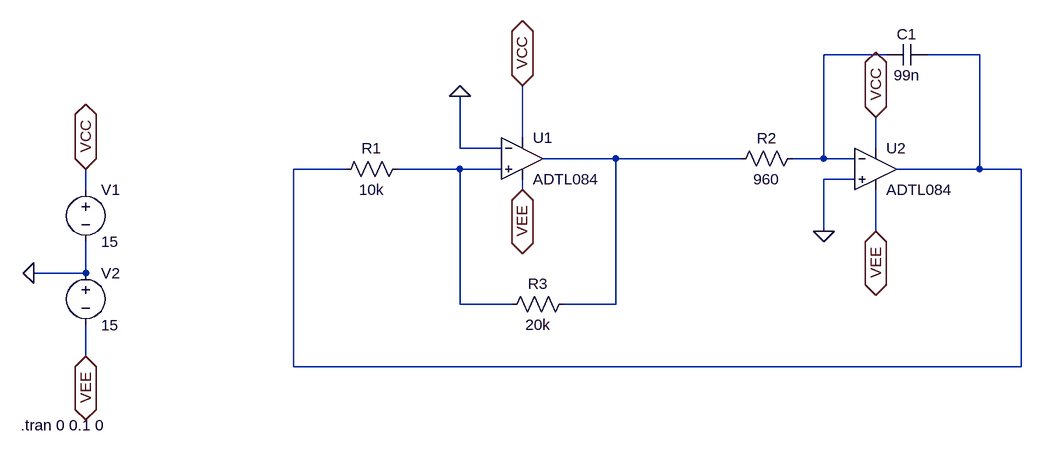
[diagram p0: schematic Oscillator_Integrator.asc]
Oscillator_Integrator.asc, the LTspice schematic file:
Version 4
SHEET 1 1444 680
WIRE 1232 -144 1136 -144
WIRE 1376 -144 1296 -144
WIRE 672 -16 672 -96
WIRE 576 0 576 -80
WIRE 640 0 576 0
WIRE 1216 0 1216 -48
WIRE 816 16 704 16
WIRE 1008 16 816 16
WIRE 1136 16 1136 -144
WIRE 1136 16 1088 16
WIRE 1184 16 1136 16
WIRE 400 32 320 32
WIRE 576 32 480 32
WIRE 640 32 576 32
WIRE 1376 32 1376 -144
WIRE 1376 32 1248 32
WIRE 1440 32 1376 32
WIRE 1184 48 1136 48
WIRE 0 64 0 32
WIRE 672 64 672 48
WIRE 1136 128 1136 48
WIRE 1216 128 1216 64
WIRE 0 192 0 144
WIRE 0 192 -80 192
WIRE 576 240 576 32
WIRE 656 240 576 240
WIRE 816 240 816 16
WIRE 816 240 736 240
WIRE 0 320 0 272
WIRE 320 336 320 32
WIRE 1440 336 1440 32
WIRE 1440 336 320 336
FLAG -80 192 0
FLAG 0 320 VEE
IOPIN 0 320 BiDir
FLAG 0 32 VCC
IOPIN 0 32 BiDir
FLAG 576 -80 0
FLAG 1136 128 0
FLAG 672 -96 VCC
IOPIN 672 -96 BiDir
FLAG 1216 -48 VCC
IOPIN 1216 -48 BiDir
FLAG 1216 128 VEE
IOPIN 1216 128 BiDir
FLAG 672 64 VEE
IOPIN 672 64 BiDir
SYMBOL voltage 0 176 R0
SYMATTR InstName V2
SYMATTR Value 15
SYMBOL voltage 0 48 R0
SYMATTR InstName V1
SYMATTR Value 15
SYMBOL res 496 16 R90
WINDOW 0 0 56 VBottom 2
WINDOW 3 32 56 VTop 2
SYMATTR InstName R1
SYMATTR Value 10k
SYMBOL res 1104 0 R90
WINDOW 0 0 56 VBottom 2
WINDOW 3 32 56 VTop 2
SYMATTR InstName R2
SYMATTR Value 960
SYMBOL OpAmps\\ADTL084 672 -48 R0
SYMATTR InstName U1
SYMBOL OpAmps\\ADTL084 1216 -32 R0
SYMATTR InstName U2
SYMBOL cap 1296 -160 R90
WINDOW 0 0 32 VBottom 2
WINDOW 3 32 32 VTop 2
SYMATTR InstName C1
SYMATTR Value 99n
SYMBOL res 752 224 R90
WINDOW 0 0 56 VBottom 2
WINDOW 3 32 56 VTop 2
SYMATTR InstName R3
SYMATTR Value 20k
TEXT -100 426 Left 2 !.tran 0 0.1 0

The netlist it stands for:
* Oscillator_Integrator.asc
V2 0 VEE 15
V1 VCC 0 15
R1 N004 N002 10k
R2 N001 N003 960
XU1 N004 0 VCC VEE N003 ADTL084  ; pins In+ In- V+ V- OUT
XU2 0 N001 VCC VEE N002 ADTL084  ; pins In+ In- V+ V- OUT
C1 N002 N001 99n
R3 N003 N004 20k
.tran 0 0.1 0
.lib ADTL084.lib
.backanno
.end